# Altium schematic sheet BNC.SchDoc
size A4; SheetNumber: 1; SheetTotal: 1
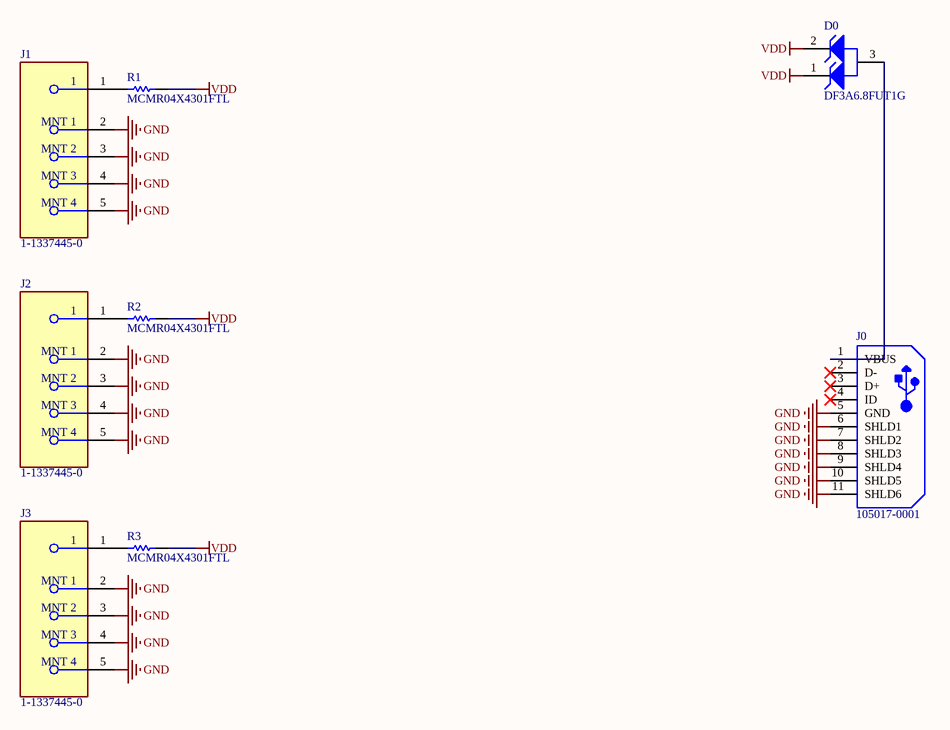
[diagram p0: BNC.SchDoc]

## Parts
D0  DF3A6.8FUT1G  [ONSC-SC-70-3-419-04_V]
J0  105017-0001  [USB-MICRO-B_V]
J1  1-1337445-0  [FP-1-1337445-0-MFG]
J2  1-1337445-0  [FP-1-1337445-0-MFG]
J3  1-1337445-0  [FP-1-1337445-0-MFG]
R1  MCMR04X4301FTL  [RESC1005X40X25LL05T10]
R2  MCMR04X4301FTL  [RESC1005X40X25LL05T10]
R3  MCMR04X4301FTL  [RESC1005X40X25LL05T10]

## Nets
GND: J0.5(GND) J0.6(SHLD1) J0.7(SHLD2) J0.8(SHLD3) J0.9(SHLD4) J0.10(SHLD5) J0.11(SHLD6) J1.2(MNT_1) J1.3(MNT_2) J1.4(MNT_3) J1.5(MNT_4) J2.2(MNT_1) J2.3(MNT_2) J2.4(MNT_3) J2.5(MNT_4) J3.2(MNT_1) J3.3(MNT_2) J3.4(MNT_3) J3.5(MNT_4)
VDD: D0.1(K1) D0.2(K2) R1.2 R2.2 R3.2
NetD0_3: D0.3(A) J0.1(VBUS)
NetJ1_1: J1.1 R1.1
NetJ2_1: J2.1 R2.1
NetJ3_1: J3.1 R3.1

Not connected (* = marked no-connect by the designer): J0 2(D-)* 3(D+)* 4(ID)*

## Library data of the parts
D0 = CMP-1063-00026-1: Zener Transient Voltage Suppressor, Dual Common Anode Zeners for ESD Protection, 3-Pin SC70, Pb-Free, Tape and Reel; Manufacturer: On Semiconductor; Number of Lines: 2; Direction: Unidirectional; IR Max (uA): 0.5; PackageDescription: 3-Pin Small Outline Transistor, Body 2 x 1.25 mm, Pitch 0.65 mm; ComponentLink3URL: http://www.onsemi.cn/pub_link/Collateral/419-04.PDF; PackageReference: SC-70-3-419-04; ComponentLink2Description: Datasheet; ComponentLink3Description: Package Specification; RoHS: Pb-Free; ComponentLink2URL: http://www.onsemi.com/pub_link/Collateral/DF3A6.8FUT1-D.PDF; Mounting Technology: Surface Mount; ComponentLink1Description: Manufacturer URL; Packing: Tape and Reel; DatasheetVersion: Rev. 1; PackageVersion: Rev. N, 11/2008; PartNumber: DF3A6.8FUT1G; ComponentLink1URL: http://www.onsemi.com/
J0 = CMP-2000-05827-1: Micro-USB B Receptacle, Right Angle, Bottom Mount, Surface Mount, with Solder Tabs, -30 to 85 degC, 5-Pin USB, RoHS, Tape and Reel; Manufacturer: Molex; Featured Product: Micro-USBConnectorsUSBConnectors; Other Names: WM1399DKR; Package Version: Rev. F, 12/2012; Number of Contacts: 5; Connector Type: USB-microB; Catalog Drawings: 1050170001; 3D Model: 105017-0001.stp; Mating Products: WM17145-ND-CABLEMICROUSBBTOSTDA1.0MWM17147-ND-CABLEMICROUSBBTOSTDA2.0MWM17146-ND-CABLEMICROUSBBTOSTDA1.5M; PCN Assembly/Origin: ResinSupplier21/Oct/2015; Voltage - Max: 30V; Online Catalog: Molex-MicroUSB; Manufacturer URL: http://www.molex.com/; Package Description: 5-Leads USB, Micro B, Body 7.5 x 5 mm, Pitch 0.65 mm; Datasheet URL: http://www.molex.com/elqNow/elqRedir.htm?ref=http://www.molex.com/webdocs/datasheets/pdf/en-us/1050170001_IO_CONNECTORS.pdf; Ingress Protection: -; Datasheet Version: 03/2016; Mounting Type: BoardCutout,SurfaceMount,RightAngle; Circuits: 5; Standard Package: 1; Package Reference: MICRO-B; Package URL: http://www.molex.com/pdm_docs/sd/1050170001_sd.pdf; Category: Connectors,Interconnects; Series: -; RoHS Information: 1050170001CertofCompliance; Features: Shielded,SolderRetention; Family: USB,DVI,HDMIConnectors; Specifications: -; Gender: Receptacle; Packaging: Digi-Reel®; Mounting Technology: SurfaceMount
J1-J3 = CMP-03357-000006-1: CONN BNC JACK STR 50 OHM PCB; PCB Mount Retention: With; Operating Frequency: 0 to 4Hz; PCB Mounting Orientation: Vertical; PCB Thickness: 0.126inch; Body Plating: Silver; Frequency: 4GHz; Impedance: 50R; Insulation Resistance: 5GR; Body Material: Brass; Dielectric Material: PTFE; Gender: Female; Sealable: No (Without); Number of Positions: 1; Orientation: Straight; RoHS Compliant: Yes; Min Operating Temperature: -65°C; Packaging: Bag; Fastening Type: Bayonet; Radiation Hardening: No; Max Frequency: 4GHz; Material: Brass; Contact Plating: Silver; ELV: Compliant; Depth: 12mm; Series: BNC; Package Quantity: 50; Connector Type: BNC; Contact Material: Brass; Max Operating Temperature: 165°C; Length: 12mm; Termination: Solder; Mount: Through Hole; Insulation Material: Polytetrafluoroethylene
R1-R3 = CMP-2002-06733-1: Manufacturer: Multicomp; Part Number: MCMR04X4301FTL